# Altium schematic sheet ALLPRINT-CAPBOARD-677512-GENERAL.SchDoc
size A3; Organization: Altium Limited; Address1: 3 Minna Close; Address2: Belrose; Address3: NSW 2085; Address4: Australia; DocumentNumber: 1; SheetNumber: 1; SheetTotal: 11
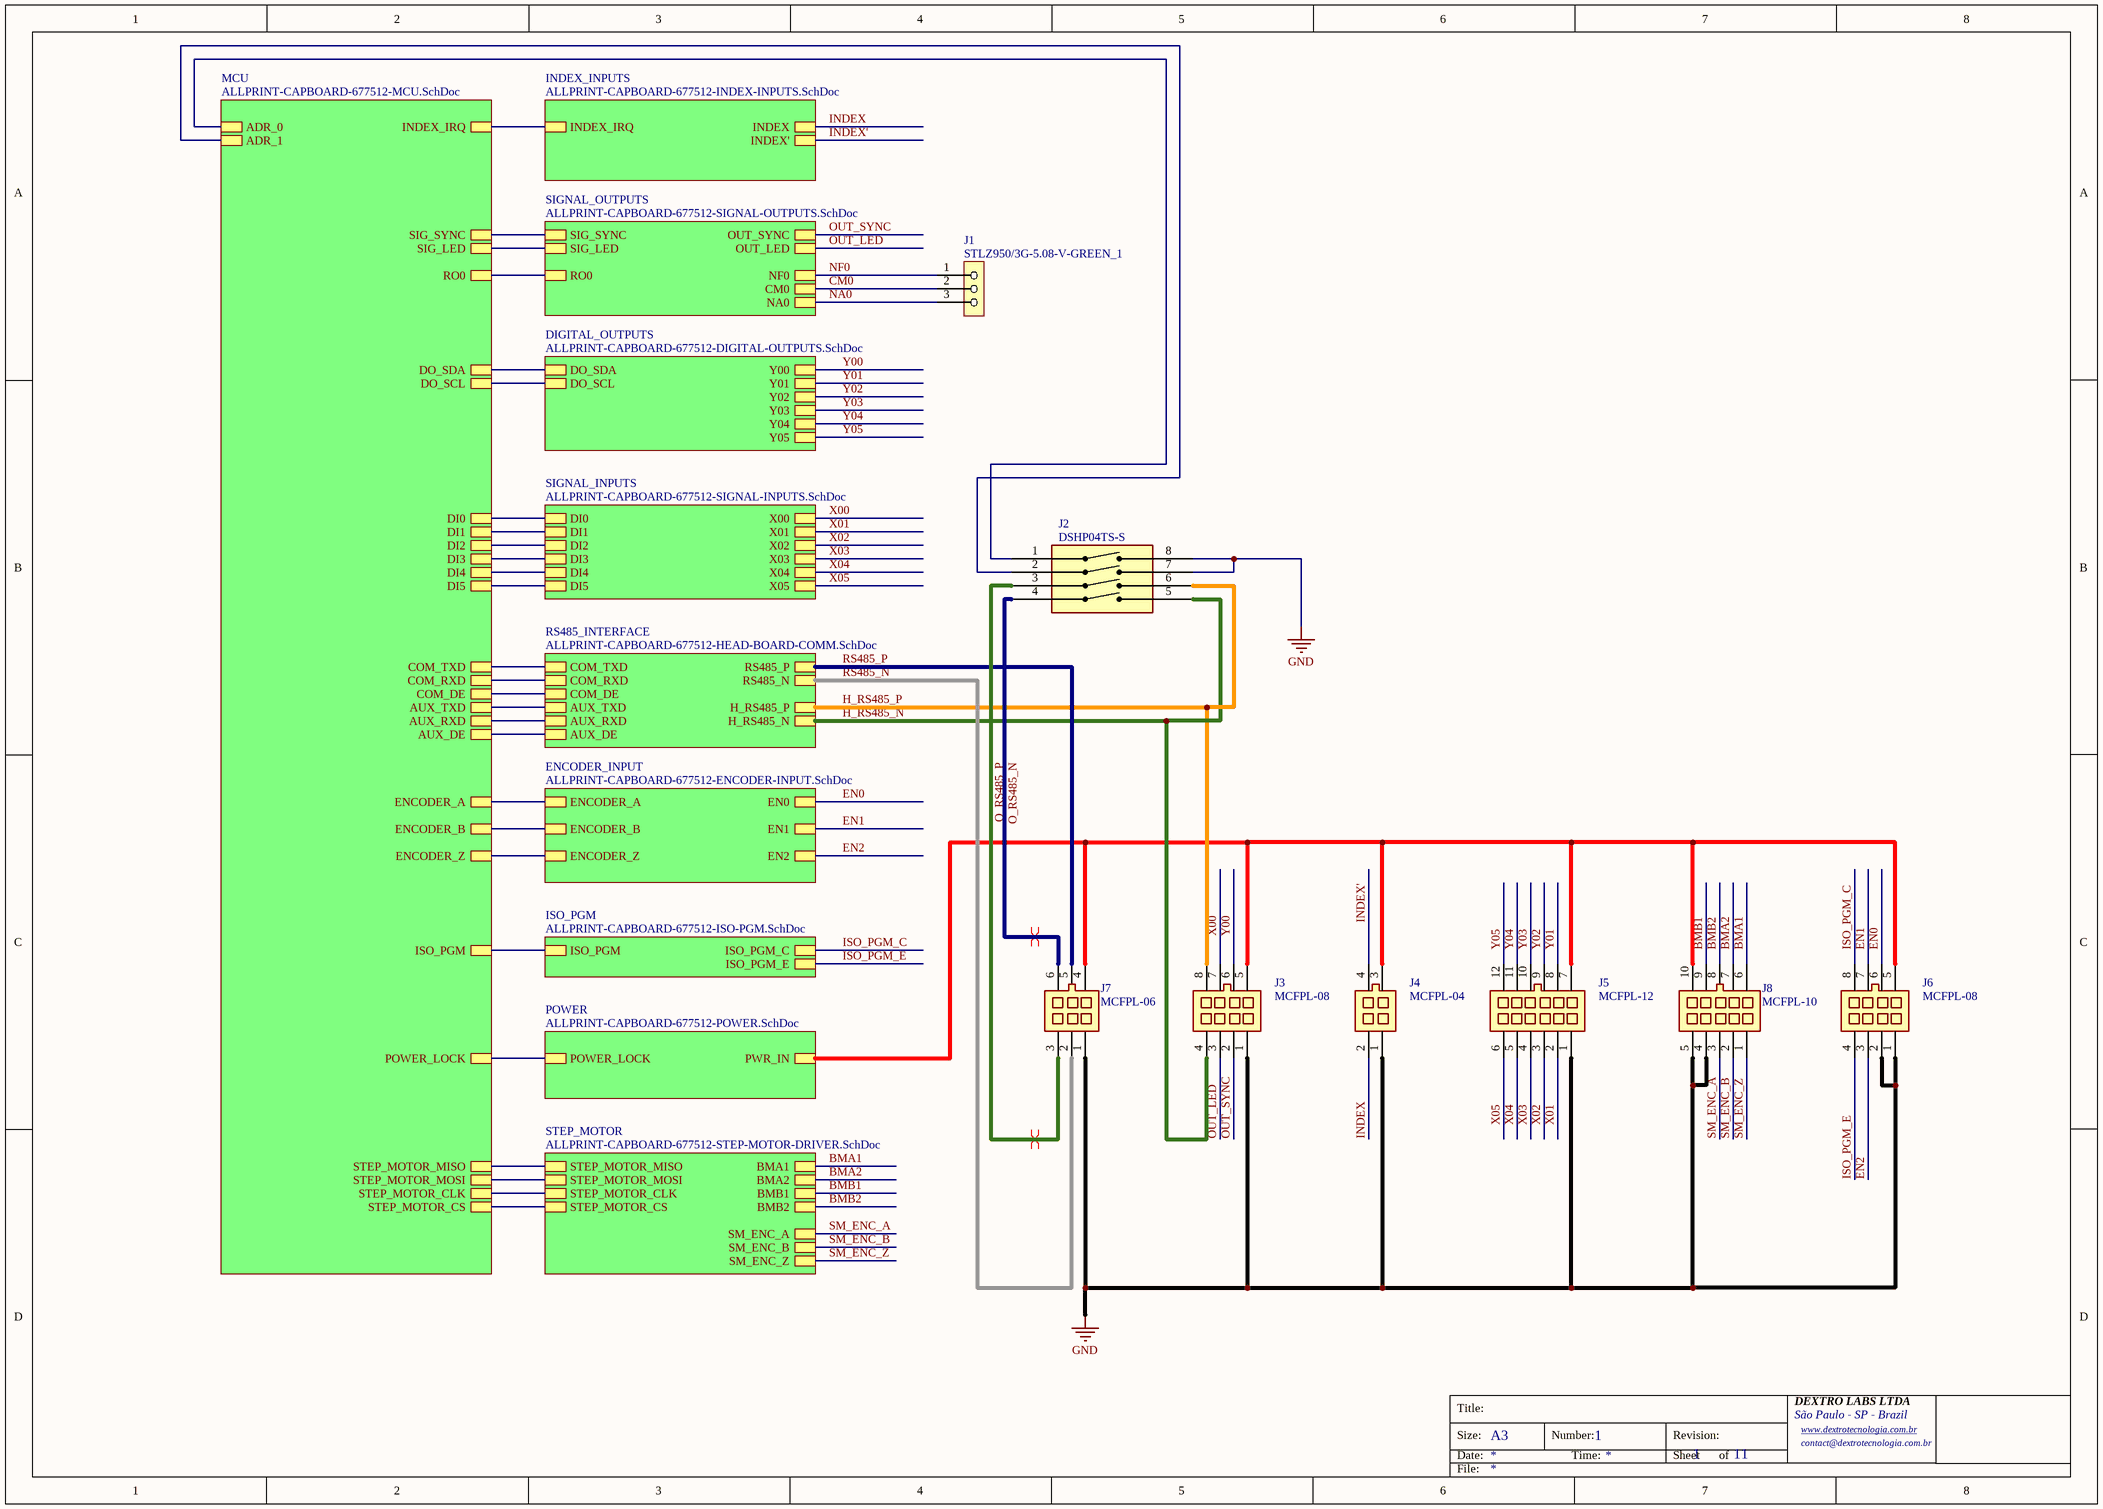
[diagram p0: ALLPRINT-CAPBOARD-677512-GENERAL.SchDoc]

## Parts
J1  STLZ950/3G-5.08-V-GREEN_1  [STLZ950/3G-5.08-V]
J2  DSHP04TS-S  [SW-SMD_8P-L6.7-W5.4-P1.27-LS8.5]
J3  MCFPL-08  [MCFPL-08]
J4  MCFPL-04  [MCFPL-04]
J5  MCFPL-12  [MCFPL-12]
J6  MCFPL-08  [MCFPL-08]
J7  MCFPL-06  [MCFPL-06]
J8  MCFPL-10  [MCFPL-10]

## Sub-sheets
DIGITAL_OUTPUTS = ALLPRINT-CAPBOARD-677512-DIGITAL-OUTPUTS.SchDoc: Y00, Y01, Y02, Y03, Y04, Y05, DO_SCL, DO_SDA
ENCODER_INPUT = ALLPRINT-CAPBOARD-677512-ENCODER-INPUT.SchDoc: ENCODER_A, ENCODER_B, ENCODER_Z, EN0, EN1, EN2
INDEX_INPUTS = ALLPRINT-CAPBOARD-677512-INDEX-INPUTS.SchDoc: INDEX, INDEX', INDEX_IRQ
ISO_PGM = ALLPRINT-CAPBOARD-677512-ISO-PGM.SchDoc: ISO_PGM, ISO_PGM_C, ISO_PGM_E
MCU = ALLPRINT-CAPBOARD-677512-MCU.SchDoc: INDEX_IRQ, SIG_SYNC, SIG_LED, RO0, DO_SDA, DO_SCL, DI0, DI1, DI2, DI3, DI4, DI5, COM_TXD, COM_RXD, COM_DE, ENCODER_A, ENCODER_B, ENCODER_Z, ISO_PGM, POWER_LOCK, STEP_MOTOR_MISO, STEP_MOTOR_MOSI, STEP_MOTOR_CLK, STEP_MOTOR_CS, AUX_TXD, AUX_RXD, AUX_DE, ADR_0, ADR_1
POWER = ALLPRINT-CAPBOARD-677512-POWER.SchDoc: POWER_LOCK, PWR_IN
RS485_INTERFACE = ALLPRINT-CAPBOARD-677512-HEAD-BOARD-COMM.SchDoc: COM_TXD, COM_RXD, RS485_P, RS485_N, COM_DE, H_RS485_P, H_RS485_N, AUX_TXD, AUX_RXD, AUX_DE
SIGNAL_INPUTS = ALLPRINT-CAPBOARD-677512-SIGNAL-INPUTS.SchDoc: X00, DI0, X01, DI1, X02, DI2, X03, DI3, X04, DI4, X05, DI5
SIGNAL_OUTPUTS = ALLPRINT-CAPBOARD-677512-SIGNAL-OUTPUTS.SchDoc: SIG_SYNC, OUT_SYNC, RO0, CM0, NA0, NF0, SIG_LED, OUT_LED
STEP_MOTOR = ALLPRINT-CAPBOARD-677512-STEP-MOTOR-DRIVER.SchDoc: BMA1, BMA2, BMB1, BMB2, STEP_MOTOR_CLK, STEP_MOTOR_MISO, STEP_MOTOR_MOSI, STEP_MOTOR_CS, SM_ENC_A, SM_ENC_B, SM_ENC_Z

## Nets
GND: J2.7 J2.8 J3.1 J4.1 J5.1 J6.1 J6.2 J7.1 J8.4 J8.5
BMA1: J8.6 ; sheet STEP_MOTOR/BMA1
BMA2: J8.7 ; sheet STEP_MOTOR/BMA2
BMB1: J8.9 ; sheet STEP_MOTOR/BMB1
BMB2: J8.8 ; sheet STEP_MOTOR/BMB2
CM0: J1.2 ; sheet SIGNAL_OUTPUTS/CM0
EN0: J6.6 ; sheet ENCODER_INPUT/EN0
EN1: J6.7 ; sheet ENCODER_INPUT/EN1
EN2: J6.3 ; sheet ENCODER_INPUT/EN2
H_RS485_N: J2.5 J3.4 ; sheet RS485_INTERFACE/H_RS485_N
H_RS485_P: J2.6 J3.8 ; sheet RS485_INTERFACE/H_RS485_P
INDEX: J4.2 ; sheet INDEX_INPUTS/INDEX
INDEX': J4.4 ; sheet INDEX_INPUTS/INDEX'
ISO_PGM_C: J6.8 ; sheet ISO_PGM/ISO_PGM_C
ISO_PGM_E: J6.4 ; sheet ISO_PGM/ISO_PGM_E
NA0: J1.3 ; sheet SIGNAL_OUTPUTS/NA0
NF0: J1.1 ; sheet SIGNAL_OUTPUTS/NF0
O_RS485_N: J2.4 J7.6
O_RS485_P: J2.3 J7.3
OUT_LED: J3.3 ; sheet SIGNAL_OUTPUTS/OUT_LED
OUT_SYNC: J3.2 ; sheet SIGNAL_OUTPUTS/OUT_SYNC
RS485_N: J7.2 ; sheet RS485_INTERFACE/RS485_N
RS485_P: J7.5 ; sheet RS485_INTERFACE/RS485_P
SM_ENC_A: J8.3 ; sheet STEP_MOTOR/SM_ENC_A
SM_ENC_B: J8.2 ; sheet STEP_MOTOR/SM_ENC_B
SM_ENC_Z: J8.1 ; sheet STEP_MOTOR/SM_ENC_Z
X00: J3.7 ; sheet SIGNAL_INPUTS/X00
X01: J5.2 ; sheet SIGNAL_INPUTS/X01
X02: J5.3 ; sheet SIGNAL_INPUTS/X02
X03: J5.4 ; sheet SIGNAL_INPUTS/X03
X04: J5.5 ; sheet SIGNAL_INPUTS/X04
X05: J5.6 ; sheet SIGNAL_INPUTS/X05
Y00: J3.6 ; sheet DIGITAL_OUTPUTS/Y00
Y01: J5.8 ; sheet DIGITAL_OUTPUTS/Y01
Y02: J5.9 ; sheet DIGITAL_OUTPUTS/Y02
Y03: J5.10 ; sheet DIGITAL_OUTPUTS/Y03
Y04: J5.11 ; sheet DIGITAL_OUTPUTS/Y04
Y05: J5.12 ; sheet DIGITAL_OUTPUTS/Y05
NetJ2_1: J2.1 ; sheet MCU/ADR_0
NetJ2_2: J2.2 ; sheet MCU/ADR_1
NetJ3_5: J3.5 J4.3 J5.7 J6.5 J7.4 J8.10 ; sheet POWER/PWR_IN
(unnamed): sheet MCU/INDEX_IRQ, sheet INDEX_INPUTS/INDEX_IRQ
(unnamed): sheet MCU/SIG_SYNC, sheet SIGNAL_OUTPUTS/SIG_SYNC
(unnamed): sheet MCU/SIG_LED, sheet SIGNAL_OUTPUTS/SIG_LED
(unnamed): sheet MCU/RO0, sheet SIGNAL_OUTPUTS/RO0
(unnamed): sheet MCU/DO_SDA, sheet DIGITAL_OUTPUTS/DO_SDA
(unnamed): sheet MCU/DO_SCL, sheet DIGITAL_OUTPUTS/DO_SCL
(unnamed): sheet MCU/DI0, sheet SIGNAL_INPUTS/DI0
(unnamed): sheet MCU/DI1, sheet SIGNAL_INPUTS/DI1
(unnamed): sheet MCU/DI2, sheet SIGNAL_INPUTS/DI2
(unnamed): sheet MCU/DI3, sheet SIGNAL_INPUTS/DI3
(unnamed): sheet MCU/DI4, sheet SIGNAL_INPUTS/DI4
(unnamed): sheet MCU/DI5, sheet SIGNAL_INPUTS/DI5
(unnamed): sheet MCU/COM_TXD, sheet RS485_INTERFACE/COM_TXD
(unnamed): sheet MCU/COM_RXD, sheet RS485_INTERFACE/COM_RXD
(unnamed): sheet MCU/COM_DE, sheet RS485_INTERFACE/COM_DE
(unnamed): sheet MCU/ENCODER_A, sheet ENCODER_INPUT/ENCODER_A
(unnamed): sheet MCU/ENCODER_B, sheet ENCODER_INPUT/ENCODER_B
(unnamed): sheet MCU/ENCODER_Z, sheet ENCODER_INPUT/ENCODER_Z
(unnamed): sheet MCU/ISO_PGM, sheet ISO_PGM/ISO_PGM
(unnamed): sheet MCU/POWER_LOCK, sheet POWER/POWER_LOCK
(unnamed): sheet MCU/STEP_MOTOR_MISO, sheet STEP_MOTOR/STEP_MOTOR_MISO
(unnamed): sheet MCU/STEP_MOTOR_MOSI, sheet STEP_MOTOR/STEP_MOTOR_MOSI
(unnamed): sheet MCU/STEP_MOTOR_CLK, sheet STEP_MOTOR/STEP_MOTOR_CLK
(unnamed): sheet MCU/STEP_MOTOR_CS, sheet STEP_MOTOR/STEP_MOTOR_CS
(unnamed): sheet MCU/AUX_TXD, sheet RS485_INTERFACE/AUX_TXD
(unnamed): sheet MCU/AUX_RXD, sheet RS485_INTERFACE/AUX_RXD
(unnamed): sheet MCU/AUX_DE, sheet RS485_INTERFACE/AUX_DE

## Layout directives
differential pair; net class DIFF120; differential pair class DIFF120: O_RS485_N, O_RS485_P

## Notes on the sheet
- Title:
- Size:
- Date:
- A3
- Number:
- Time:
- Revision:
- Sheet
- of
- DEXTRO LABS LTDA
- São Paulo - SP - Brazil
- www.dextrotecnologia.com.br <http://www.dextrotecnologia.com.br>
- contact@dextrotecnologia.com.br
- File:

## Library data of the parts
J1 = STLZ950/3G-5.08-V-GREEN: CONECTOR PHOENIX MECANO 3 VIAS PASSO 5,08mm VERDE 180º
J2 = DSHP04TS-S: 4 24V 25mA SPST 3,000 Cycles Black Slide, Recessed SMD-8P,6.7x5.4mm DIP Switches/SIP Switches ROHS; LCSC: C319050
J3 J6 = MCFPL-08: CONECTOR-METALTEX-PASSO-3mm-90 GRAUS MONTAGEM PLACA-COMPATIVEL MICROFIT-8VIAS / 5A-250VCA
J4 = MCFPL-04: CONECTOR-METALTEX-PASSO-3mm-90 GRAUS MONTAGEM PLACA-COMPATIVEL MICROFIT-4VIAS / 5A-250VCA
J5 = MCFPL-12: CONECTOR-METALTEX-PASSO-3mm-90 GRAUS MONTAGEM PLACA-COMPATIVEL MICROFIT-12VIAS / 5A-250VCA
J7 = MCFPL-06: CONECTOR-METALTEX-PASSO-3mm-90 GRAUS MONTAGEM PLACA-COMPATIVEL MICROFIT-6VIAS / 5A-250VCA
J8 = MCFPL-10: CONECTOR-METALTEX-PASSO-3mm-90 GRAUS MONTAGEM PLACA-COMPATIVEL MICROFIT-10VIAS / 5A-250VCA